# EasyEDA schematic SCH_M5 Stick RedHat++ Shield_2022-06-05.json

## Sheets
1 RedHat++ Shield Main: TITLE: RedHat++ Shield; REV: 0.9; Date: 2021-09-05; Sheet: 1/6; Drawn By: Hans R. Tanner; Company: IoTT - Internet of Toy Trains
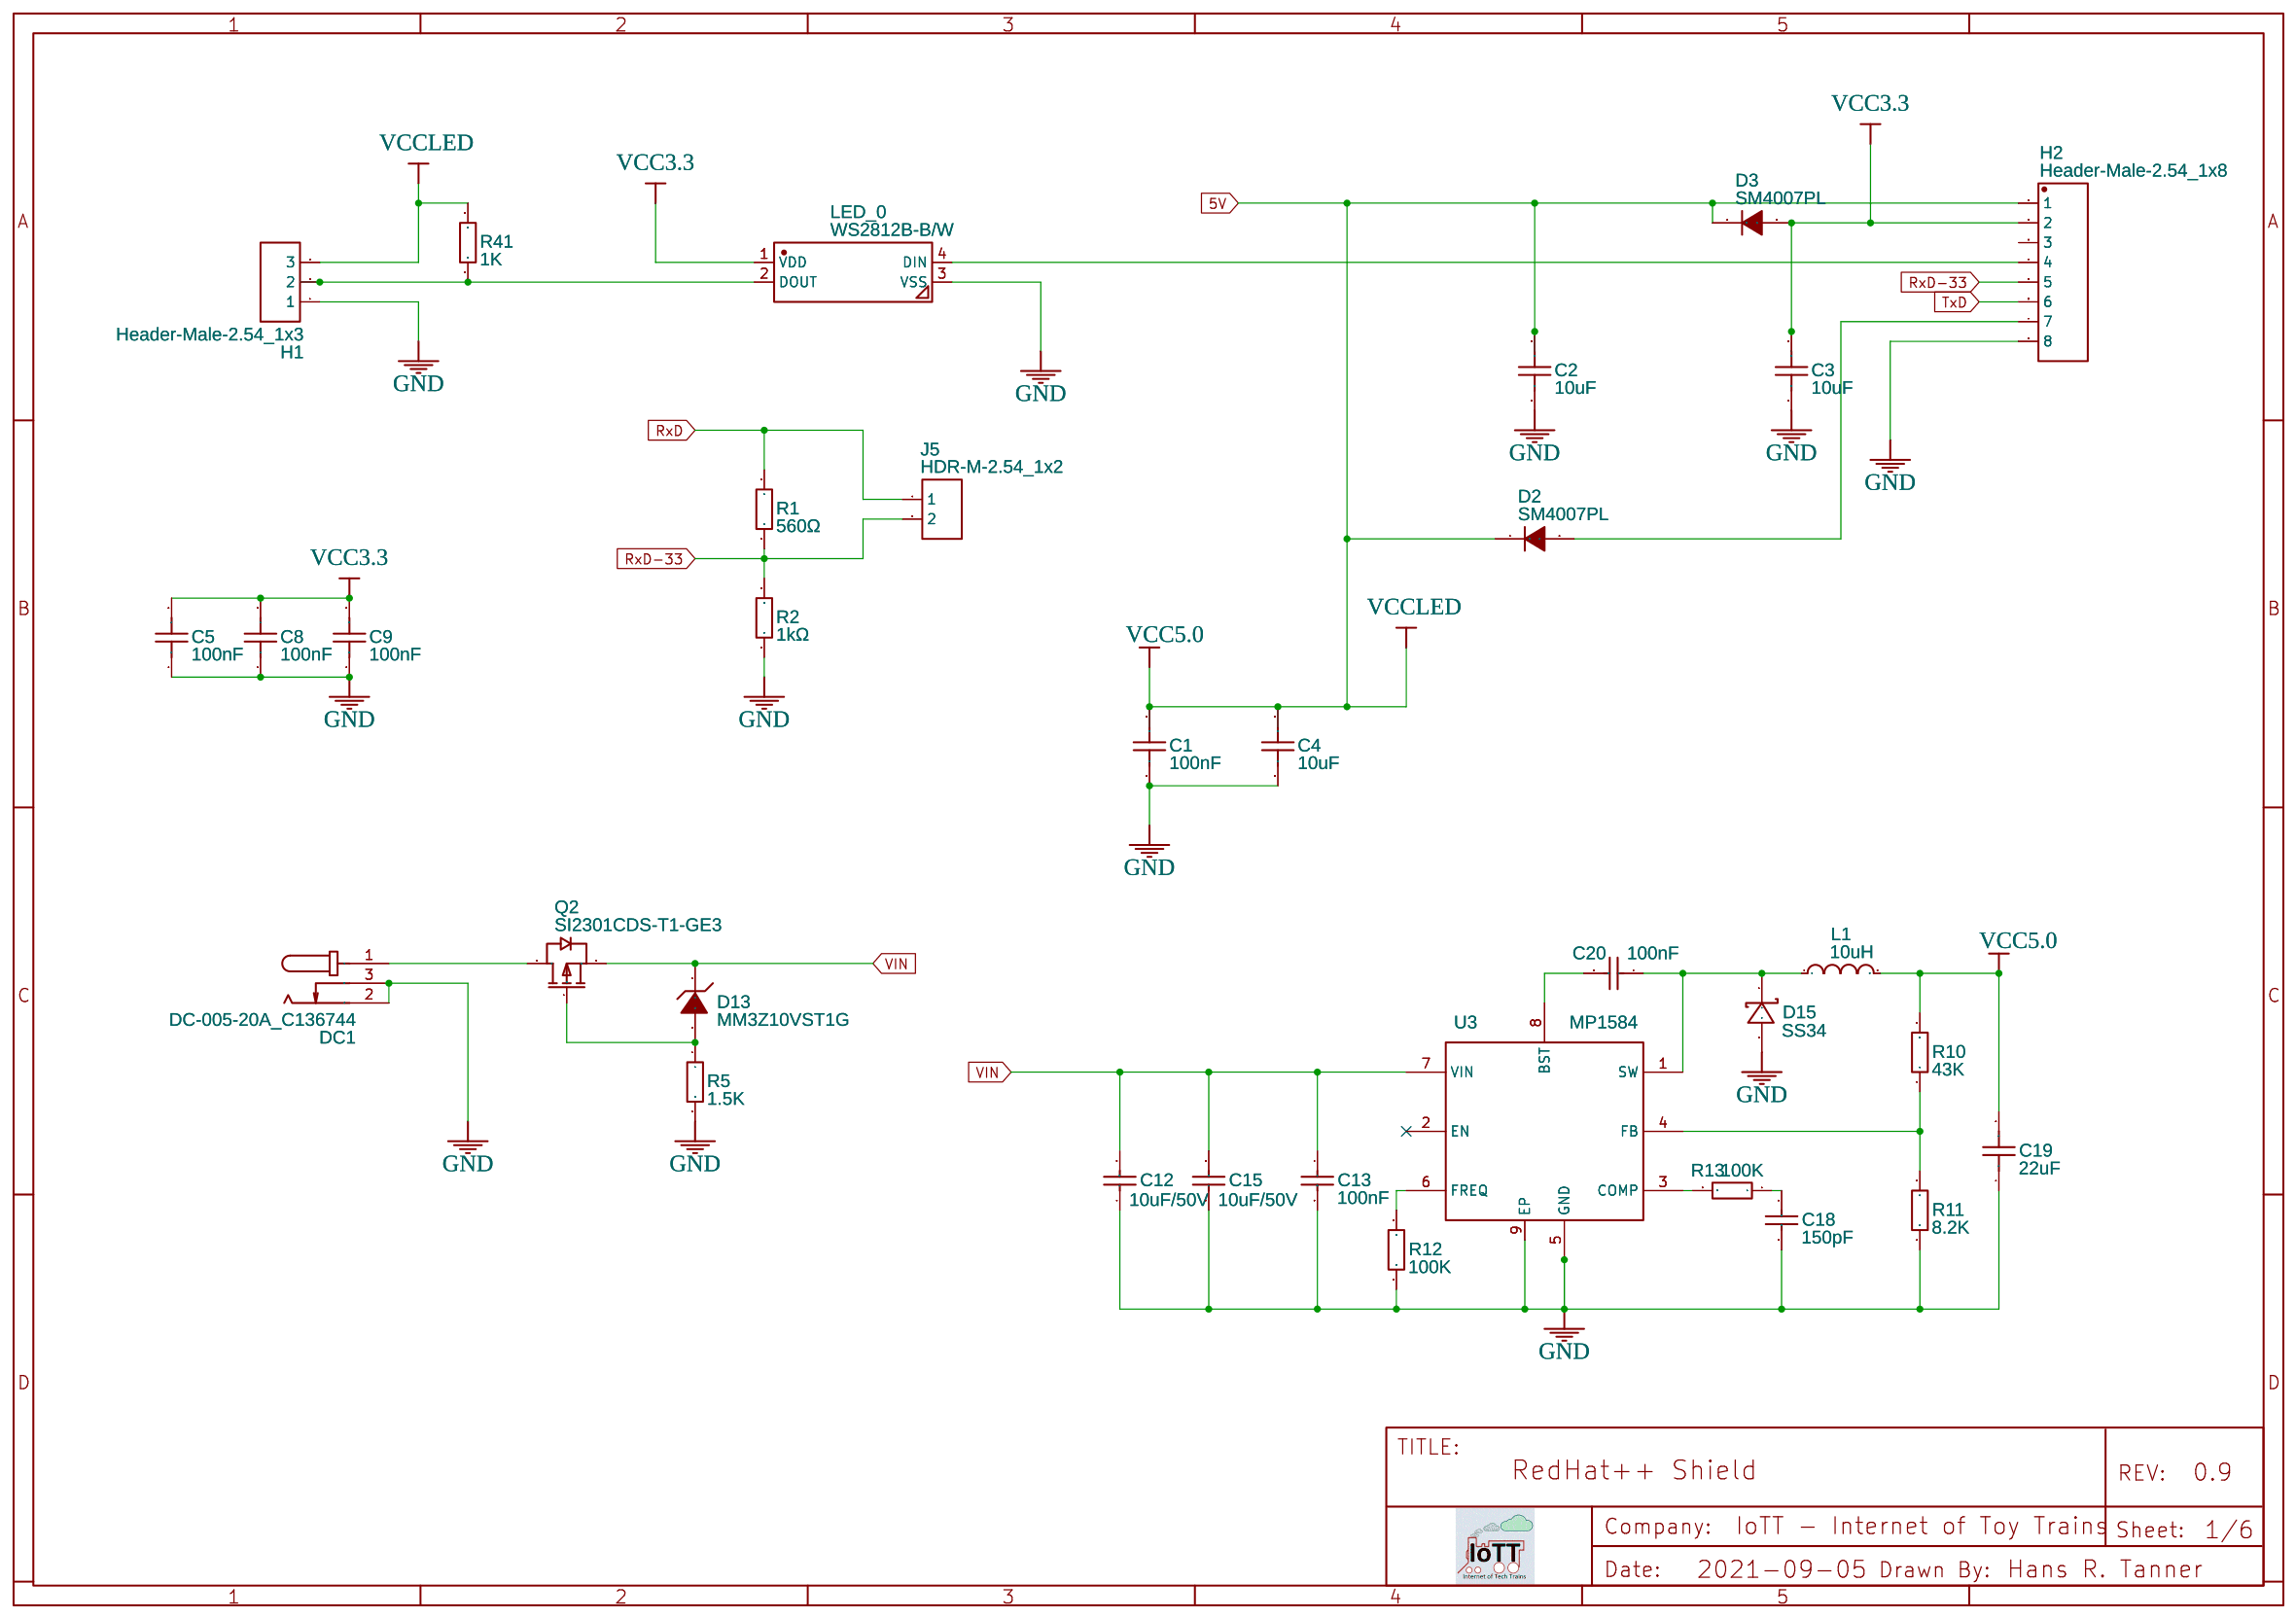
[diagram p0: RedHat++ Shield Main]
2 LocoNet: TITLE: RedHat++ LocoNet; REV: 1.0; Date: 2021-10-27; Sheet: 6/6; Drawn By: Hans Tanner
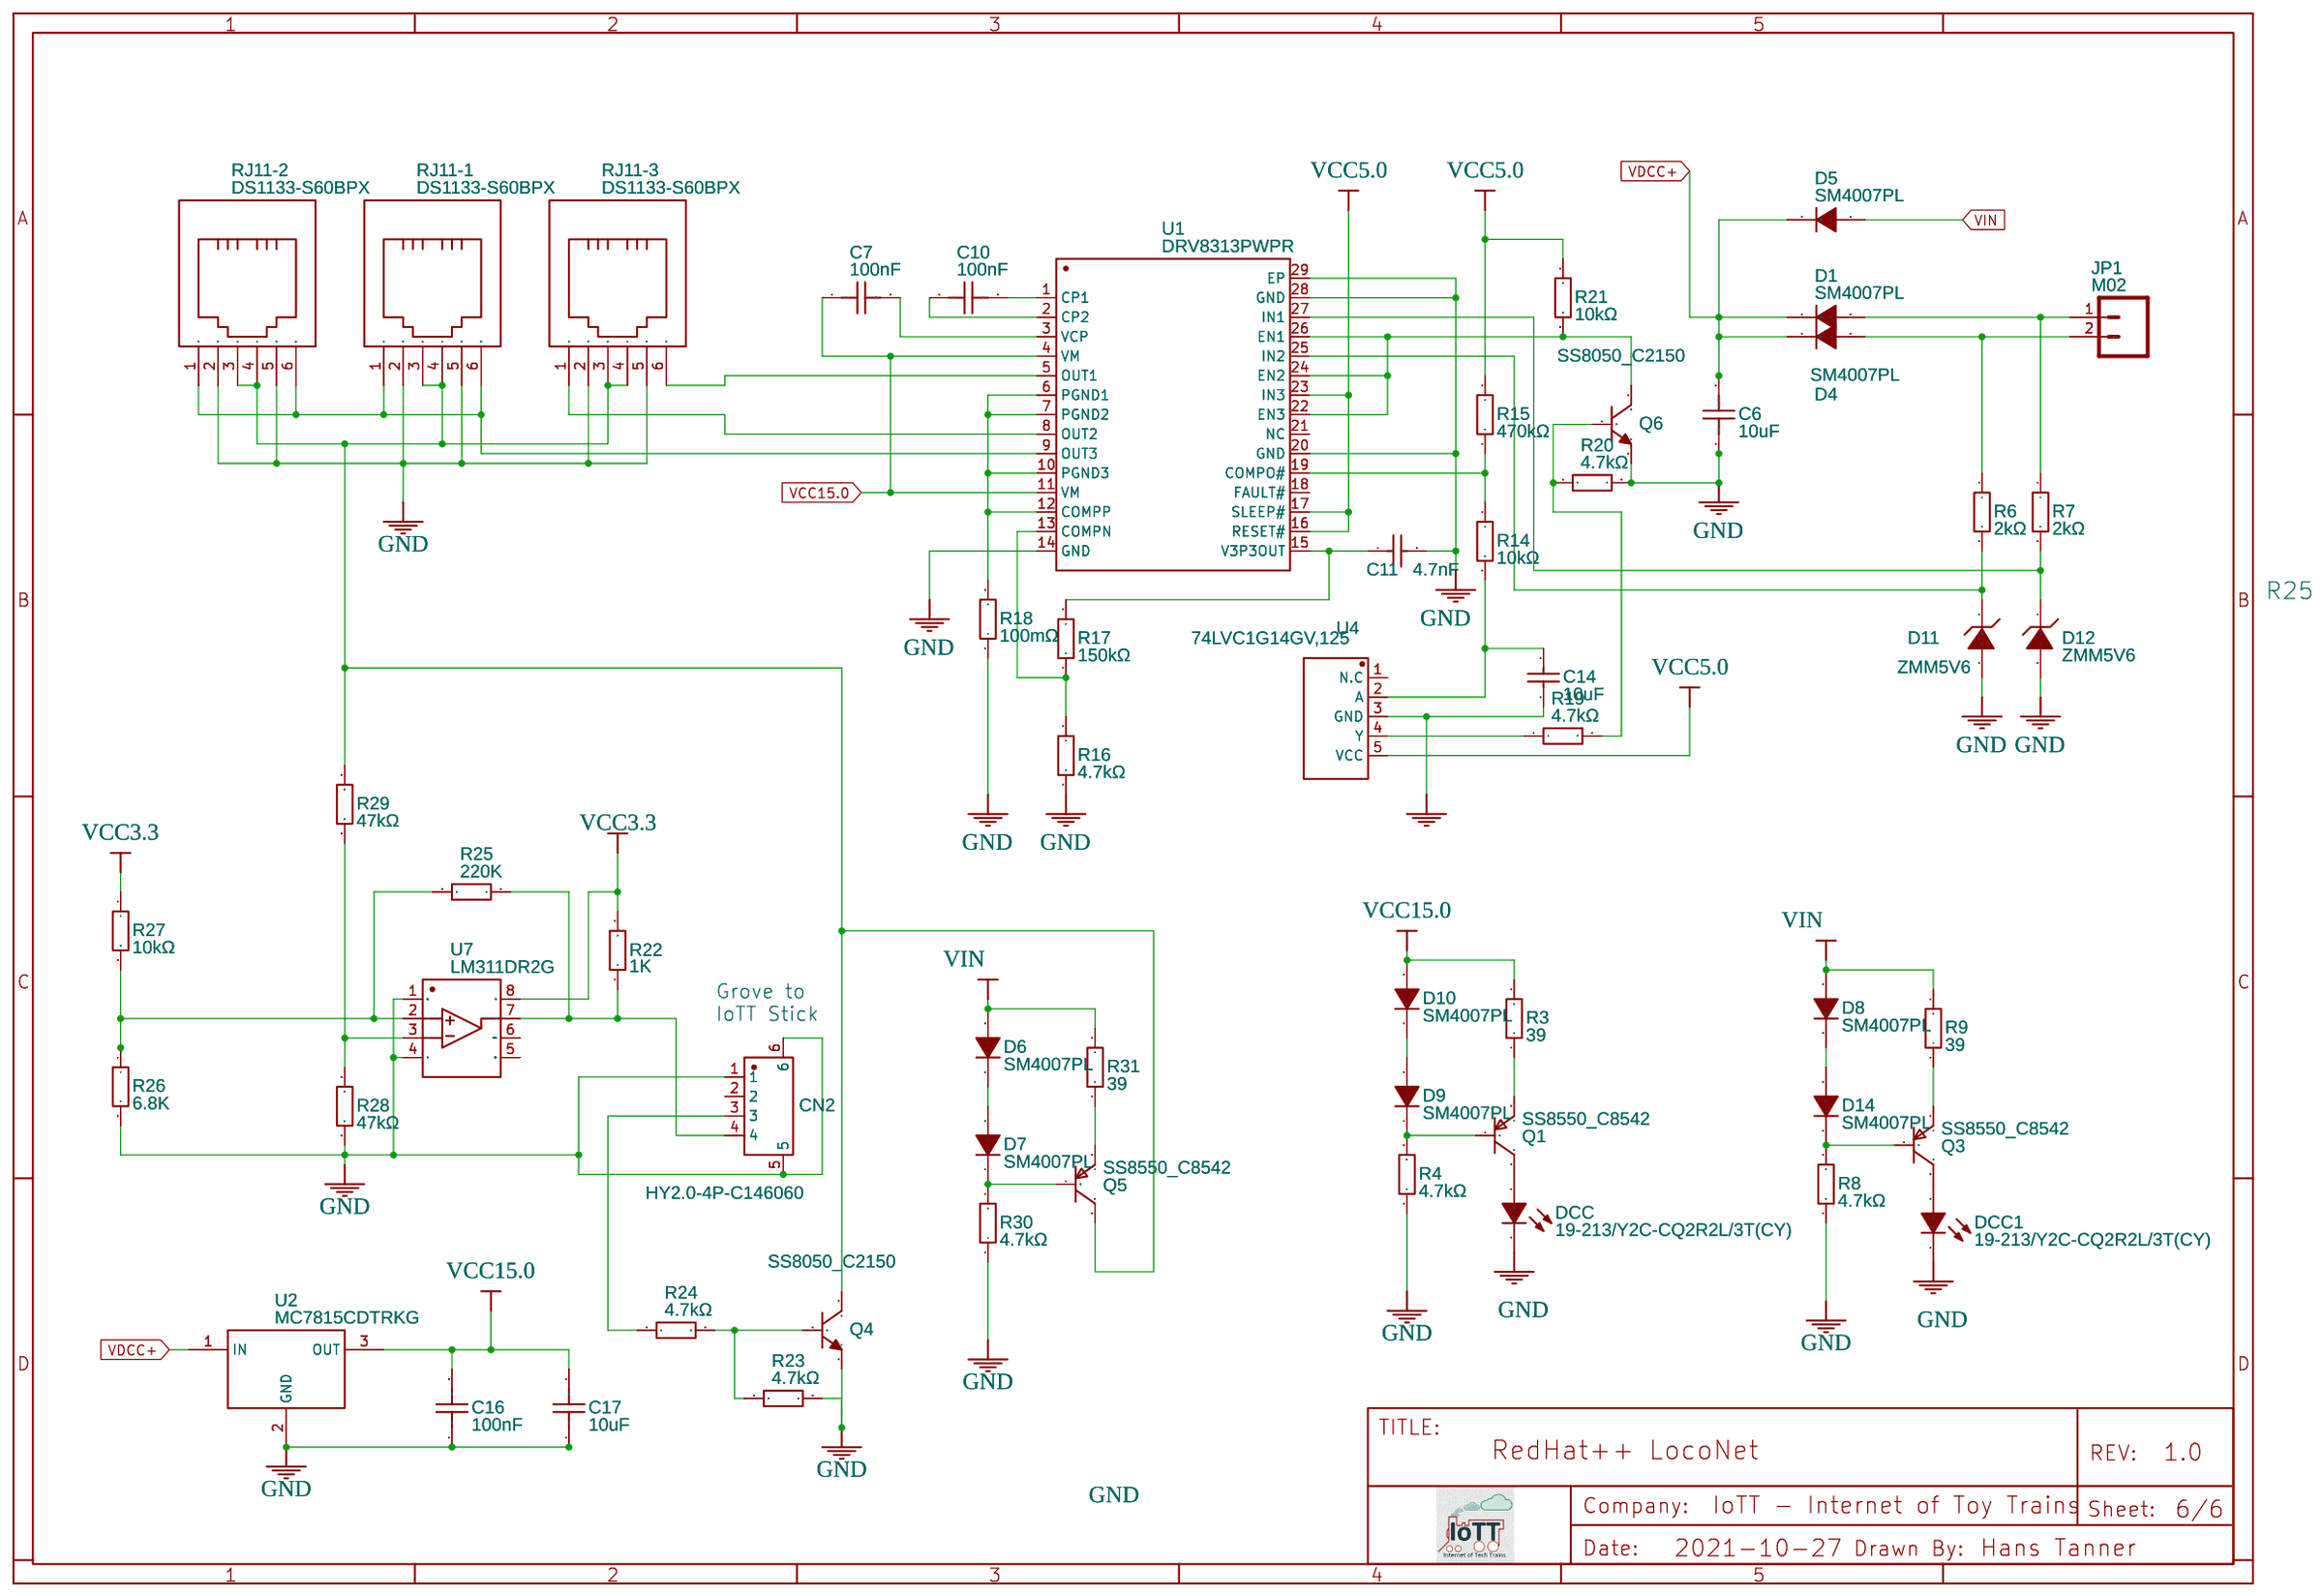
[diagram p1: LocoNet]
3 Arduino Headers: REV: 1.0; Date: 2022-04-23; Sheet: 1/1; Drawn By: Hans Tanner
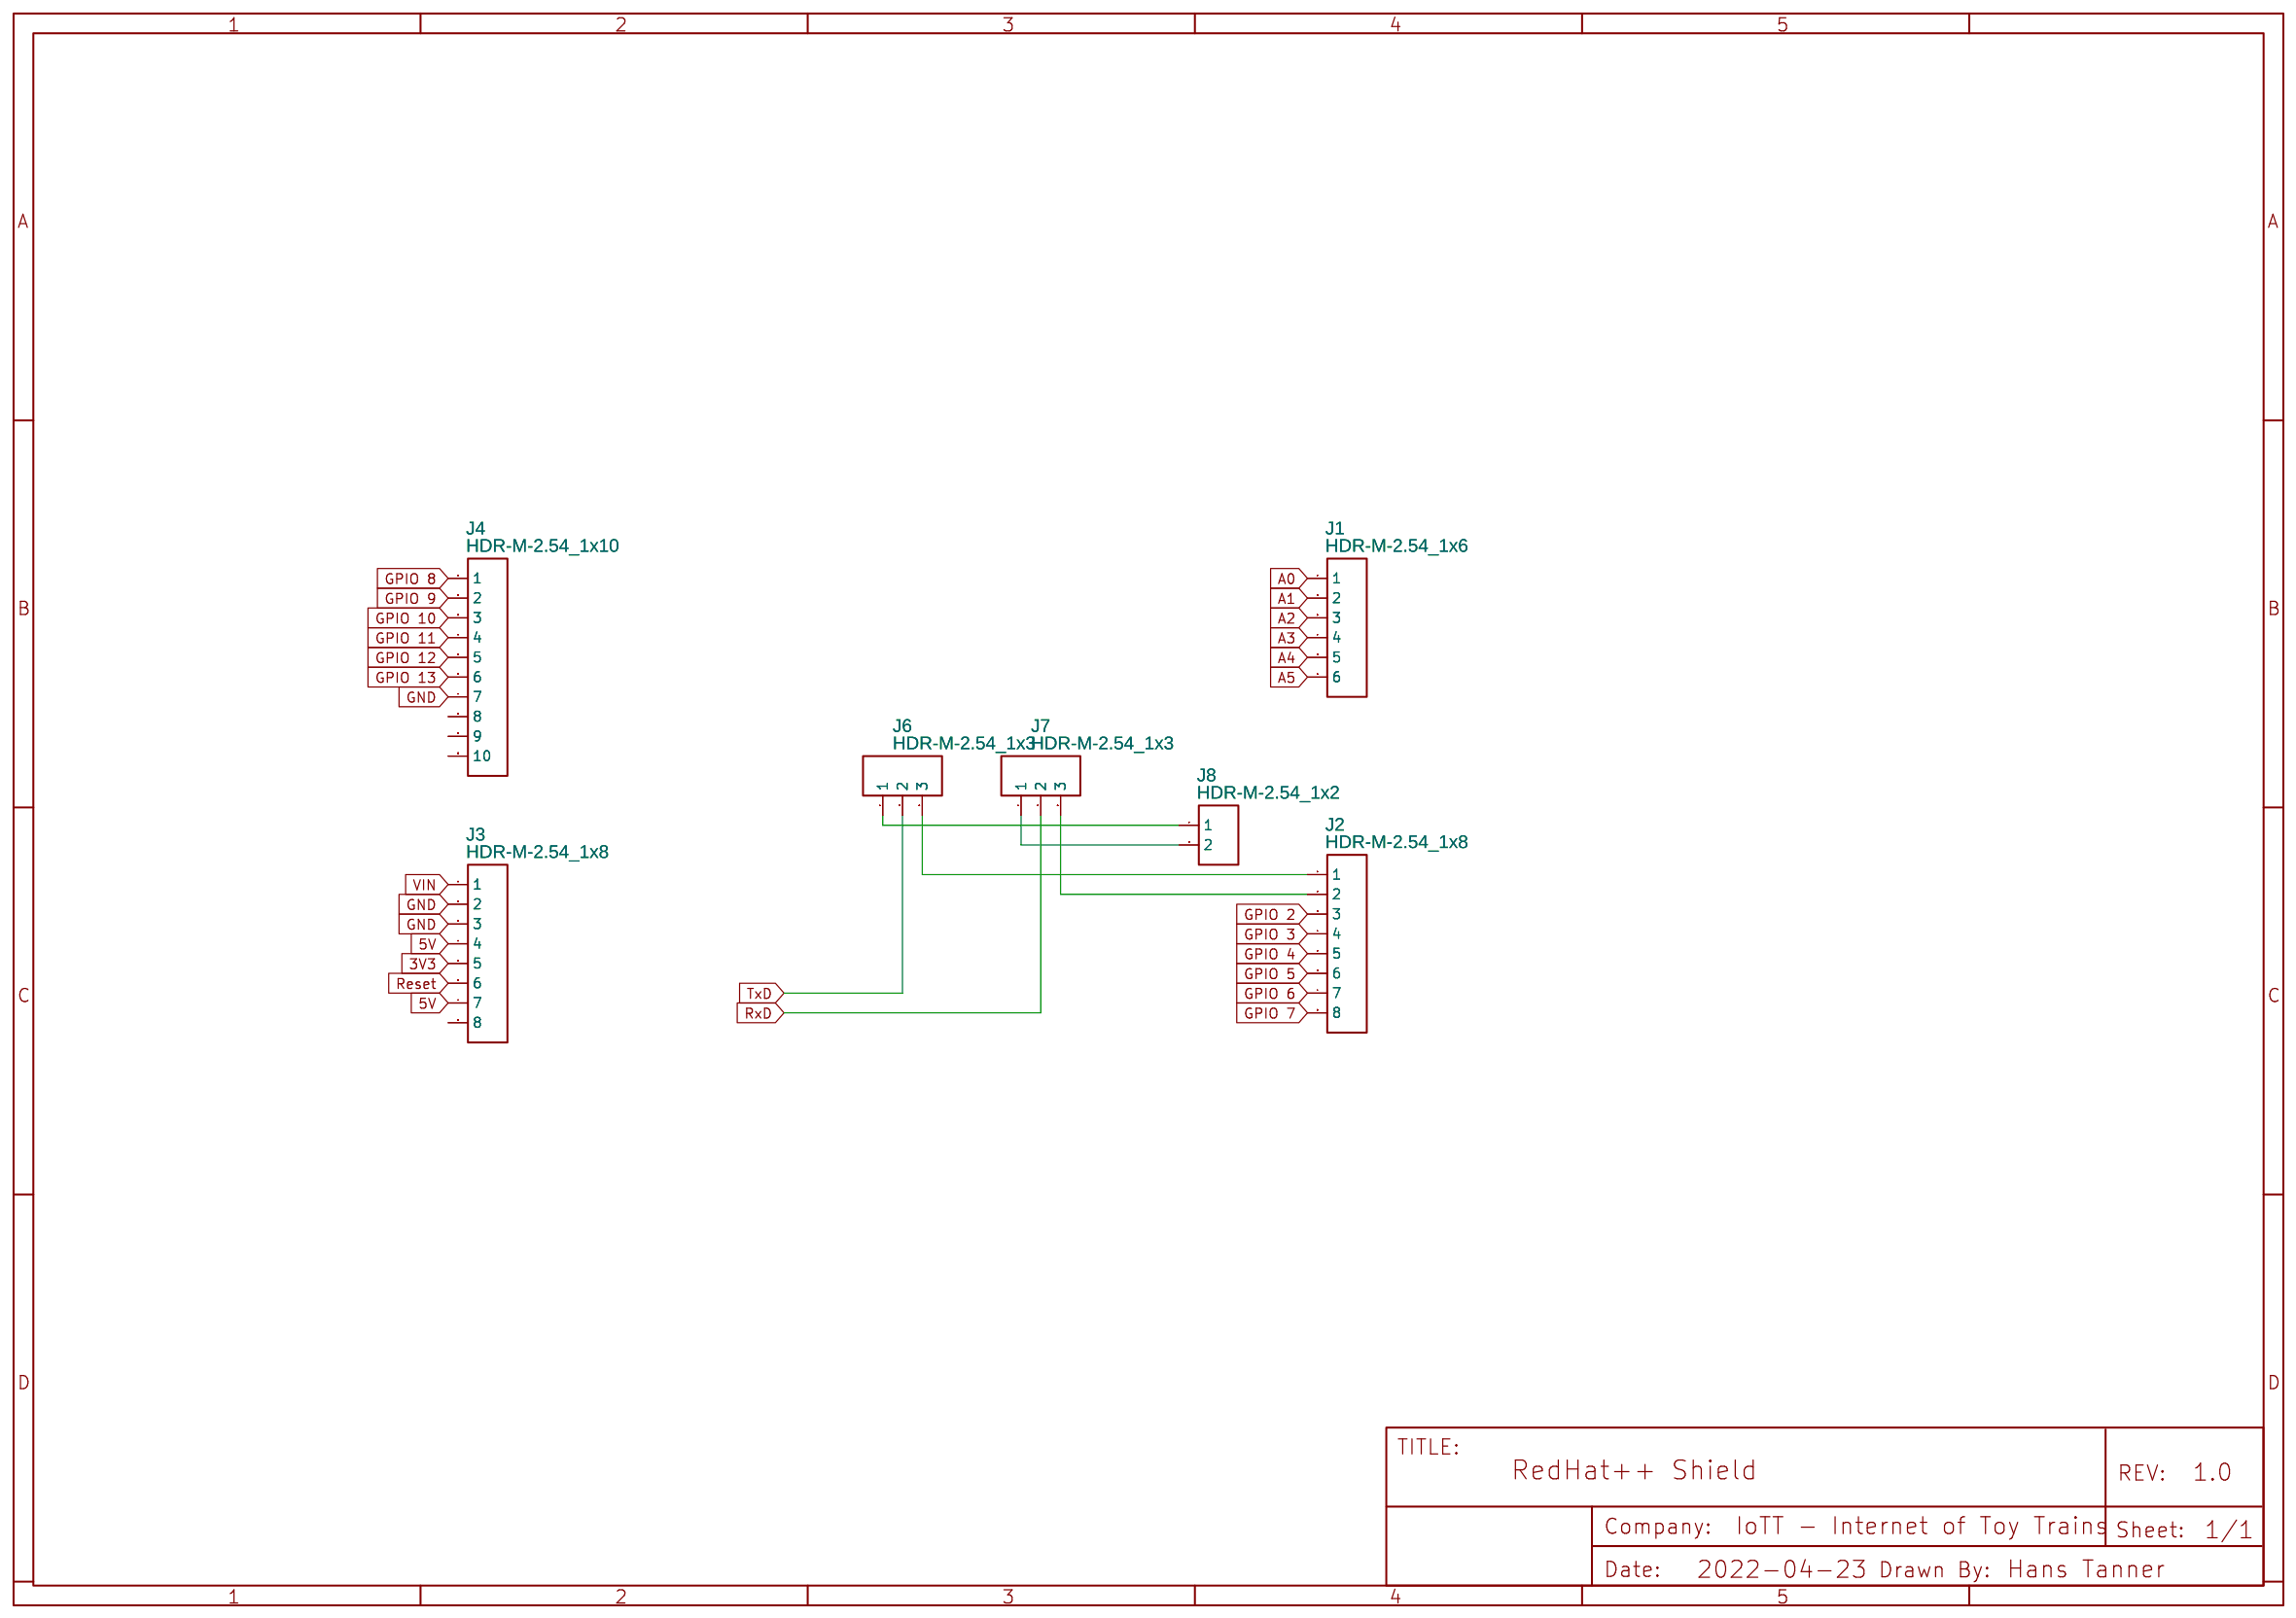
[diagram p2: Arduino Headers]

## Parts
sheet Arduino Headers
J1  HDR-M-2.54_1x6  [HDR-M-2.54_1X6]
J2  HDR-M-2.54_1x8  [HDR-M-2.54_1X8]
J3  HDR-M-2.54_1x8  [HDR-M-2.54_1X8]
J4  HDR-M-2.54_1x10  [HDR-M-2.54_1X10]
J6  HDR-M-2.54_1x3  [HDR-M-2.54_1X3]
J7  HDR-M-2.54_1x3  [HDR-M-2.54_1X3]
J8  HDR-M-2.54_1x2  [HDR-M-2.54_1X2]
sheet LocoNet
C6  10uF  [C0805]
C7  100nF  [C0603]
C10  100nF  [C0603]
C11  4.7nF  [C0402]
C14  10uF  [C0805]
C16  100nF  [C0603]
C17  10uF  [C0805]
CN2  HY2.0-4P-C146060  [CONN-SMD_HY2.0-4P]
D1  SM4007PL  [SOD-123F_L2.8-W1.8-LS3.7-RD]
D4  SM4007PL  [SOD-123F_L2.8-W1.8-LS3.7-RD]
D5  SM4007PL  [SOD-123F_L2.8-W1.8-LS3.7-RD]
D6  SM4007PL  [SOD-123F_L2.8-W1.8-LS3.7-RD]
D7  SM4007PL  [SOD-123F_L2.8-W1.8-LS3.7-RD]
D8  SM4007PL  [SOD-123F_L2.8-W1.8-LS3.7-RD]
D9  SM4007PL  [SOD-123F_L2.8-W1.8-LS3.7-RD]
D10  SM4007PL  [SOD-123F_L2.8-W1.8-LS3.7-RD]
D11  ZMM5V6  [LL-34_L3.5-W1.5-RD]
D12  ZMM5V6  [LL-34_L3.5-W1.5-RD]
D14  SM4007PL  [SOD-123F_L2.8-W1.8-LS3.7-RD]
DCC  19-213/Y2C-CQ2R2L/3T(CY)  [LED0603-R-RD]
DCC1  19-213/Y2C-CQ2R2L/3T(CY)  [LED0603-R-RD]
JP1  M02  [SCREWTERMINAL-3.5MM-2-NS]
Q1  SS8550_C8542  [SOT-23-3_L2.9-W1.3-P1.90-LS2.4-BR]
Q3  SS8550_C8542  [SOT-23-3_L2.9-W1.3-P1.90-LS2.4-BR]
Q4  SS8050_C2150  [SOT-23-3_L2.9-W1.3-P1.90-LS2.4-BR]
Q5  SS8550_C8542  [SOT-23-3_L2.9-W1.3-P1.90-LS2.4-BR]
Q6  SS8050_C2150  [SOT-23-3_L2.9-W1.3-P1.90-LS2.4-BR]
R3  39  [R0603]
R4  4.7kΩ  [R0402]
R6  2kΩ  [R0402]
R7  2kΩ  [R0402]
R8  4.7kΩ  [R0402]
R9  39  [R0603]
R14  10kΩ  [R0402]
R15  470kΩ  [R0603]
R16  4.7kΩ  [R0402]
R17  150kΩ  [R0603]
R18  100mΩ  [R1206]
R19  4.7kΩ  [R0402]
R20  4.7kΩ  [R0402]
R21  10kΩ  [R0402]
R22  1K  [R0402]
R23  4.7kΩ  [R0402]
R24  4.7kΩ  [R0402]
R25  220K  [R0603]
R26  6.8K  [R0603]
R27  10kΩ  [R0402]
R28  47kΩ  [R0402]
R29  47kΩ  [R0402]
R30  4.7kΩ  [R0402]
R31  39  [R0603]
RJ11-1  DS1133-S60BPX  [DS1133-S60BPX]
RJ11-2  DS1133-S60BPX  [DS1133-S60BPX]
RJ11-3  DS1133-S60BPX  [DS1133-S60BPX]
U1  DRV8313PWPR  [HTSSOP-28_L9.8-W4.5-P0.65-LS6.6-BL-EP]
U2  MC7815CDTRKG  [TO-252-2_L6.6-W6.1-P4.57-LS9.9-TL-CW]
U4  74LVC1G14GV,125  [SOT-753_L3.1-W1.7-P0.95-LS3.0-BR]
U7  LM311DR2G  [SOIC-8_L5.0-W4.0-P1.27-LS6.0-BL]
sheet RedHat++ Shield Main
C1  100nF  [C0603]
C2  10uF  [C0805]
C3  10uF  [C0805]
C4  10uF  [C0805]
C5  100nF  [C0603]
C8  100nF  [C0603]
C9  100nF  [C0603]
C12  10uF/50V  [C1206]
C13  100nF  [C1206]
C15  10uF/50V  [C1206]
C18  150pF  [C0805]
C19  22uF  [C0805]
C20  100nF  [C1206]
D2  SM4007PL  [SOD-123F_L2.8-W1.8-LS3.7-RD]
D3  SM4007PL  [SOD-123F_L2.8-W1.8-LS3.7-RD]
D13  MM3Z10VST1G  [SOD-323_L1.8-W1.3-LS2.5-RD]
D15  SS34  [DO-214AC_SS34_PAD_DISTANCE_UPDATED]
DC1  DC-005-20A_C136744  [DC-IN-TH_DC-005-20A]
H1  Header-Male-2.54_1x3  [HDR-TH_3P-P2.54-V]
H2  Header-Male-2.54_1x8  [210S-1X8P]
J5  HDR-M-2.54_1x2  [HDR-M-2.54_1X2]
L1  10uH  [IND-SMD_L7.1-W6.6]
LED_0  WS2812B-B/W  [LED-SMD_4P-L5.0-W5.0-TL_WS2812B-B]
Q2  SI2301CDS-T1-GE3  [SOT-23-3_L3.0-W1.7-P0.95-LS2.9-BR]
R1  560Ω  [R0603]
R2  1kΩ  [R0402]
R5  1.5K  [R0402]
R10  43K  [R0805]
R11  8.2K  [R0805]
R12  100K  [R0805]
R13  100K  [R0805]
R41  1K  [R0402]
U3  MP1584  [SOIC-8_L5.0-W4.0-P1.27-LS6.0-BL-EP]

## Library data of the parts
J1 = HDR-M-2.54_1x6: Supplier Part: C190819; Supplier: LCSC; Contributor: LCEDA_Lib
J2 J3 = HDR-M-2.54_1x8: Supplier Part: C190820; Supplier: LCSC; Contributor: LCEDA_Lib
J4 = HDR-M-2.54_1x10: Supplier Part: C57369; Supplier: LCSC; Contributor: LCEDA_Lib
J6 J7 = HDR-M-2.54_1x3: Supplier Part: C180248; Supplier: LCSC; Contributor: LCEDA_Lib
J5 J8 = HDR-M-2.54_1x2: Supplier Part: C124375; Supplier: LCSC; Contributor: LCEDA_Lib
C2-C4 C6 C17 = GRM21BR61H106KE43L: Supplier: LCSC; Supplier Part: C440198; Manufacturer: Murata Electronics; Contributor: LCSC; JLCPCB Part Class: Basic Part
C1 C5 C7-C10 C16 = CC0603KRX7R9BB104: Supplier: LCSC; Manufacturer: YAGEO; Supplier Part: C14663; JLCPCB Part Class: Basic Part
C11 = 0402B472K500NT: Supplier: LCSC; Manufacturer: FH; LCSC Assembly: Yes; Supplier Part: C1538; SMT Type: Basic
C14 = CL21A106KAYNNNE: Supplier: LCSC; Manufacturer: SAMSUNG; LCSC Assembly: Yes; Supplier Part: C15850; SMT Type: Basic
CN2 = HY2.0-4P-C146060: Supplier: LCSC; Supplier Part: C146060; Manufacturer: Boom Precision Elec; Contributor: LCSC
D1-D10 D14 = SM4007PL: Supplier: LCSC; Manufacturer: MDD; image: //image.lceda.cn/szlcsc/C64898.jpg; Supplier Part: C64898; LCSC Assembly: Yes; SMT Type: Basic
D11 D12 = ZMM5V6: Supplier: LCSC; Manufacturer: SEMTECH; Supplier Part: C8062; JLCPCB Part Class: Basic Part
DCC DCC1 = 19-213/Y2C-CQ2R2L/3T(CY): Supplier: LCSC; Manufacturer: EVERLIGHT; Supplier Part: C72038; JLCPCB Part Class: Basic Part
JP1 = M02: Contributor: SparkFun
Q1 Q3 Q5 = SS8550_C8542: Supplier: LCSC; Manufacturer: CJ; Manufacturer Part: SS8550; Supplier Part: C8542; JLCPCB Part Class: Basic Part
Q4 Q6 = SS8050_C2150: Supplier: LCSC; Manufacturer: CJ; Manufacturer Part: SS8050; LCSC Assembly: Yes; image: //image.lceda.cn/szlcsc/C2150.jpg; Supplier Part: C2150; SMT Type: Basic
R3 R9 R31 = TC0325B390JT5E: Supplier: LCSC; Manufacturer: UniOhm; Contributor: LCSC; Supplier Part: C146566; LCSC Assembly: Yes; SMT Type: Extend
R4 R8 R16 R19 R20 R23 R24 R30 = 0402WGF4701TCE: Supplier: LCSC; Manufacturer: UniOhm; Supplier Part: C25900; Resistance (Ohms): 4.7K; JLCPCB Part Class: Basic Part
R6 R7 = 0402WGF2001TCE: Supplier: LCSC; Manufacturer: UniOhm; Supplier Part: C4109; Resistance (Ohms): 2K; JLCPCB Part Class: Basic Part
R14 R21 R27 = 0402WGF1002TCE: Supplier: LCSC; Manufacturer: UniOhm; Supplier Part: C25744; Resistance (Ohms): 10K; JLCPCB Part Class: Basic Part
R15 = 0603WAF4703T5E: Supplier: LCSC; Manufacturer: UniOhm; Supplier Part: C23178; Resistance (Ohms): 470K; JLCPCB Part Class: Basic Part
R17 = 0603WAF1503T5E: Supplier: LCSC; Manufacturer: UniOhm; Supplier Part: C22807; Resistance (Ohms): 150K; JLCPCB Part Class: Basic Part
R18 = 1206W4F100LT5E: Supplier: LCSC; Manufacturer: UniOhm; Supplier Part: C25334; Resistance (Ohms): 0.1; JLCPCB Part Class: Basic Part
R22 = 0402WGF1001TCE: Supplier: LCSC; Manufacturer: UniOhm; Supplier Part: C11702; SMT Type: Basic; JLCPCB SMD: Yes; LCSC Assembly: Yes
R25 = 0603WAF2203T5E: Supplier: LCSC; Manufacturer: UniOhm; LCSC Assembly: Yes; Supplier Part: C22961; SMT Type: Basic
R26 = 0603WAF6801T5E: Supplier: LCSC; Manufacturer: UniOhm; LCSC Assembly: Yes; Supplier Part: C23212; SMT Type: Basic
R28 R29 = 0402WGF4702TCE: Supplier: LCSC; Manufacturer: UniOhm; Supplier Part: C25792; Resistance (Ohms): 47K; JLCPCB Part Class: Basic Part
RJ11-1-RJ11-3 = -: Supplier: LCSC; Manufacturer: CONNFLY; Supplier Part: C77859
U1 = DRV8313PWPR: Supplier: LCSC; Supplier Part: C92482; Manufacturer: Texas Instruments; Contributor: LCSC; LCSC Assembly: Yes; SMT Type: Extend
U2 = MC7815CDTRKG: Supplier: LCSC; Manufacturer: ON; Contributor: LCSC; Supplier Part: C133887; JLCPCB Part Class: Extended Part
U4 = 74LVC1G14GV,125: Supplier: LCSC; Manufacturer: Nexperia; Supplier Part: C131093; JLCPCB Part Class: Extended Part
U7 = LM311DR2G: Supplier: LCSC; Supplier Part: C231850; Manufacturer: ON Semicon; Contributor: LCSC; LCSC Assembly: Yes; SMT Type: Extend
C12 C15 = CL31A106KBHNNNE: Supplier: LCSC; Manufacturer: SAMSUNG; LCSC Assembly: Yes; Supplier Part: C13585; SMT Type: Basic
C13 C20 = CL31B104KBCNNNC: Supplier: LCSC; Manufacturer: SAMSUNG; LCSC Assembly: Yes; Supplier Part: C24497; SMT Type: Basic
C18 = 0805B151K500NT: Supplier: LCSC; Manufacturer: FH; LCSC Assembly: Yes; Supplier Part: C1716; SMT Type: Basic
C19 = CL21A226MAQNNNE: Supplier: LCSC; Manufacturer: SAMSUNG; LCSC Assembly: Yes; Supplier Part: C45783; SMT Type: Basic
D13 = MM3Z10VST1G: Supplier: LCSC; Supplier Part: C235983; Manufacturer: ON Semicon; Contributor: LCSC; LCSC Assembly: Yes; SMT Type: Extend
D15 = SS34_C8678: Supplier: LCSC; Manufacturer: MDD; image: //image.lceda.cn/szlcsc/C8678.jpg; Supplier Part: C8678; LCSC Assembly: Yes; SMT Type: Basic
DC1 = DC-005-20A_C136744: Supplier: LCSC; Manufacturer: HRO; Manufacturer Part: DC-005-20A; Contributor: LCSC; Supplier Part: C136744
H1 = Header-Male-2.54_1x3: Supplier: LCSC; Manufacturer: BOOMELE; Manufacturer Part: Header2.54mm 1*3P; image: //image.lceda.cn/szlcsc/C49257.jpg; Supplier Part: C49257
H2 = Header-Male-2.54_1x8: Supplier: LCSC; Manufacturer: Ckmtw; Manufacturer Part: 210S-1*8P L=11.6MMGold-plated black; Contributor: LCSC; Supplier Part: C124381
L1 = MWSA0603-100MT: Supplier: LCSC; Manufacturer: Sunlord; Contributor: LCSC; Supplier Part: C132141; LCSC Assembly: Yes; SMT Type: Extend
LED_0 = WS2812B-B/W: Supplier: LCSC; Supplier Part: C2761795; Manufacturer: worldsemi; Contributor: LCSC; JLCPCB Part Class: Extended Part
Q2 = SI2301CDS-T1-GE3: Supplier: LCSC; Manufacturer: VISHAY; LCSC Assembly: Yes; image: //image.lceda.cn/szlcsc/C10487.jpg; Supplier Part: C10487; SMT Type: Basic
R1 = 0603WAF5600T5E: Supplier: LCSC; Manufacturer: UniOhm; Supplier Part: C23204; Resistance (Ohms): 560; JLCPCB Part Class: Basic Part
R2 = 0402WGF1001TCE: Supplier: LCSC; Manufacturer: UniOhm; Supplier Part: C11702; Resistance (Ohms): 1K; JLCPCB Part Class: Basic Part
R5 = 0402WGF1501TCE: Supplier: LCSC; Manufacturer: UniOhm; LCSC Assembly: Yes; Supplier Part: C25867; SMT Type: Basic
R10 = 0805W8F4302T5E: Supplier: LCSC; Manufacturer: UniOhm; LCSC Assembly: Yes; Supplier Part: C17695; SMT Type: Basic
R11 = 0805W8F8201T5E: Supplier: LCSC; Manufacturer: UniOhm; LCSC Assembly: Yes; Supplier Part: C17828; SMT Type: Basic
R12 R13 = 0805W8F1003T5E: Supplier: LCSC; Manufacturer: UniOhm; LCSC Assembly: Yes; Supplier Part: C17407; SMT Type: Basic
R41 = 0402WGF1001TCE: Supplier: LCSC; Manufacturer: UniOhm; Supplier Part: C11702; JLCPCB Part Class: Basic Part
U3 = MP1584EN-LF-Z: Supplier: LCSC; Manufacturer: MPS; LCSC Assembly: Yes; image: //image.lceda.cn/szlcsc/C15051.jpg; Supplier Part: C15051; SMT Type: Basic; Contributor: aikopras

## Nets
3V3: J3.5
5V: C1.2 C2.2 C4.2 C19.2 D2.1(C) D3.1(C) H1.3 H2.1 J3.4 J3.7 L1.2 R10.2 R15.1 R21.1 R41.2 U1.16(RESET#) U1.17(SLEEP#) U1.23(IN3) U4.5(VCC)
GND: C1.1 C2.1 C3.1 C4.1 C5.1 C6.1 C8.1 C9.1 C11.2 C12.1 C13.2 C14.1 C15.1 C16.1 C17.1 C18.1 C19.1 CN2.1 CN2.5 CN2.6 D11.2(A) D12.2(A) D15.2(A) DC1.2 DC1.3 DCC.2(C) DCC1.2(C) H1.1 H2.8 J3.2 J3.3 J4.7 LED_0.3(VSS) Q4.2(E) Q6.2(E) R2.1 R4.1 R5.2 R8.1 R11.1 R12.2 R16.1 R18.1 R20.2 R23.2 R26.2 R28.2 R30.1 RJ11-1.2 RJ11-1.5 RJ11-2.2 RJ11-2.5 RJ11-3.2 RJ11-3.5 U1.14(GND) U1.20(GND) U1.28(GND) U1.29(EP) U2.2(GND) U3.5(GND) U3.9(EP) U4.3(GND) U7.1(GND) U7.4(VEE)
VCC3.3: C3.2 C5.2 C8.2 C9.2 D3.2(A) H2.2 LED_0.1(VDD) R22.2 R27.1 U7.8(VCC)
VCC15.0: C7.1 C16.2 C17.2 D10.2(A) R3.2 U1.4(VM) U1.11(VM) U2.3(OUT)
VIN: C12.2 C13.1 C15.2 D5.2(A) D6.2(A) D8.2(A) D13.1(K) J3.1 Q2.2(S) R9.2 R31.2 U3.7(VIN)
A0: J1.1
A1: J1.2
A2: J1.3
A3: J1.4
A4: J1.5
A5: J1.6
GPIO 2: J2.3
GPIO 3: J2.4
GPIO 4: J2.5
GPIO 5: J2.6
GPIO 6: J2.7
GPIO 7: J2.8
GPIO 8: J4.1
GPIO 9: J4.2
GPIO 10: J4.3
GPIO 11: J4.4
GPIO 12: J4.5
GPIO 13: J4.6
Reset: J3.6
RxD: J5.1 J7.2 R1.2
RxD-33: H2.5 J5.2 R1.1 R2.2
TxD: H2.6 J6.2
VDCC+: C6.2 D1.1(C) D4.1(C) D5.1(C) U2.1(IN)
Net-(C7-2): C7.2 U1.3(VCP)
Net-(C10-1): C10.1 U1.2(CP2)
Net-(C10-2): C10.2 U1.1(CP1)
Net-(C11-1): C11.1 R17.2 U1.15(V3P3OUT)
Net-(C14-2): C14.2 R14.2 U4.2(A)
Net-(C18-2): C18.2 R13.1
Net-(C20-1): C20.1 D15.1(K) L1.1 U3.1(SW)
Net-(C20-2): C20.2 U3.8(BST)
Net-(CN2-3): CN2.3 R24.1
Net-(CN2-4): CN2.4 R22.1 R25.2 U7.7
Net-(D1-2): D1.2(A) JP1.1 R7.1
Net-(D2-2): D2.2(A) H2.7
Net-(D4-2): D4.2(A) JP1.2 R6.1
Net-(D6-1): D6.1(C) D7.2(A)
Net-(D7-1): D7.1(C) Q5.1(B) R30.2
Net-(D8-1): D8.1(C) D14.2(A)
Net-(D9-1): D9.1(C) Q1.1(B) R4.2
Net-(D9-2): D9.2(A) D10.1(C)
Net-(D11-1): D11.1(C) R6.2 U1.25(IN2)
Net-(D12-1): D12.1(C) R7.2 U1.27(IN1)
Net-(D13-2): D13.2(A) Q2.1(G) R5.1
Net-(D14-1): D14.1(C) Q3.1(B) R8.2
Net-(DC1-1): DC1.1 Q2.3(D)
Net-(DCC1-1): DCC1.1(A) Q3.3(C)
Net-(DCC-1): DCC.1(A) Q1.3(C)
Net-(H1-2): H1.2 LED_0.2(DOUT) R41.1
Net-(H2-4): H2.4 LED_0.4(DIN)
Net-(J2-1): J2.1 J6.3
Net-(J2-2): J2.2 J7.3
Net-(J6-1): J6.1 J8.1
Net-(J7-1): J7.1 J8.2
Net-(Q1-2): Q1.2(E) R3.1
Net-(Q3-2): Q3.2(E) R9.1
Net-(Q4-1): Q4.1(B) R23.1 R24.2
Net-(Q4-3): Q4.3(C) Q5.3(C) R29.1 RJ11-1.3 RJ11-1.4 RJ11-2.3 RJ11-2.4 RJ11-3.3 RJ11-3.4
Net-(Q5-2): Q5.2(E) R31.1
Net-(Q6-1): Q6.1(B) R19.2 R20.1
Net-(Q6-3): Q6.3(C) R21.2 U1.22(EN3) U1.24(EN2) U1.26(EN1)
Net-(R10-1): R10.1 R11.2 U3.4(FB)
Net-(R12-1): R12.1 U3.6(FREQ)
Net-(R13-2): R13.2 U3.3(COMP)
Net-(R14-1): R14.1 R15.2 U1.19(COMPO#)
Net-(R16-2): R16.2 R17.1 U1.13(COMPN)
Net-(R18-2): R18.2 U1.6(PGND1) U1.7(PGND2) U1.10(PGND3) U1.12(COMPP)
Net-(R19-1): R19.1 U4.4(Y)
Net-(R25-1): R25.1 R26.1 R27.2 U7.2
Net-(R28-1): R28.1 R29.2 U7.3
Net-(RJ11-1-1): RJ11-1.1 RJ11-1.6 RJ11-2.1 RJ11-2.6 U1.9(OUT3)
Net-(RJ11-3-1): RJ11-3.1 U1.8(OUT2)
Net-(RJ11-3-6): RJ11-3.6 U1.5(OUT1)

Not connected (* = marked no-connect by the designer): CN2 2; H2 3; J3 8; J4 8 9 10; U1 18(FAULT#) 21(NC); U3 2(EN)*; U4 1(N.C); U7 5(BALANCE) 6(BALANCE/STROBE)

## Notes on the sheets
sheet 2
- R25
- Grove to
  IoTT Stick
